# Altium schematic sheet Receiver.SchDoc
size A4; SheetNumber: 3; SheetTotal: 3
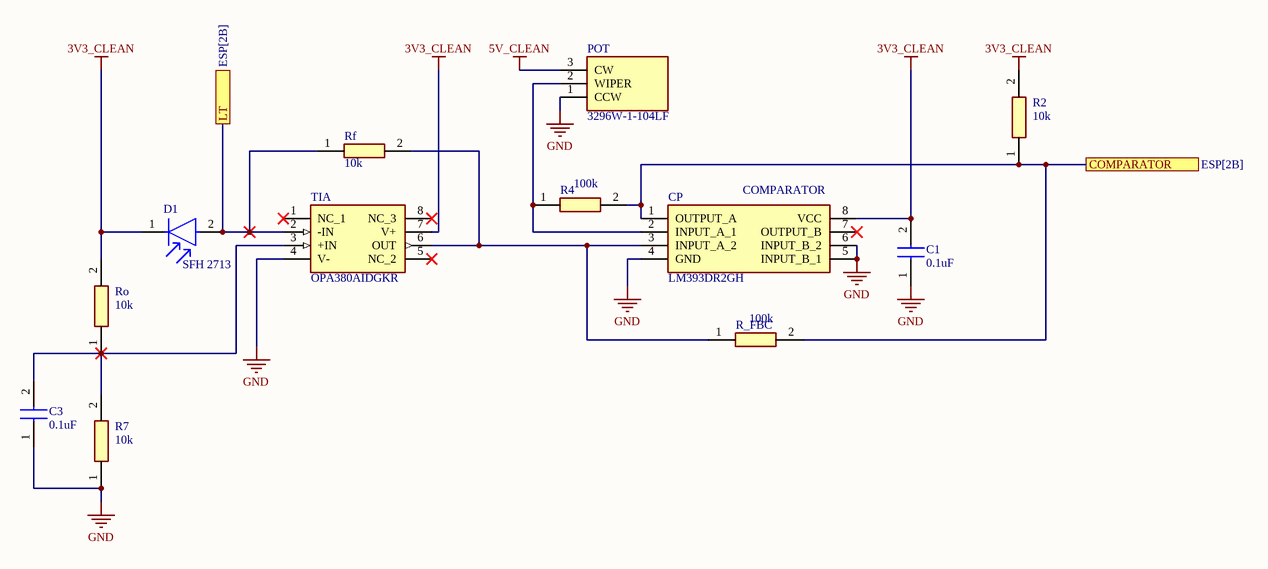
[diagram p0: Receiver.SchDoc]

## Parts
C1  0.1uF  [CAPC0603X33N]
C3  0.1uF  [CAPC0603X33N]
CP  LM393DR2GH  [SOIC127P600X175-8N]
D1  SFH 2713  [FP-SFH_2713-MFG]
POT  3296W-1-104LF  [3296W1503LF]
R2  10k  [RESC1608X55N]
R4  100k  [RESC1005X40N]
R7  10k  [RESC1608X55N]
R_FBC  100k  [RESC1005X40N]
Rf  10k  [RESC1608X55N]
Ro  10k  [RESC1608X55N]
TIA  OPA380AIDGKR  [SOP65P490X110-8N]

## Ports
COMPARATOR (see ESP[2B]), LT (see ESP[2B])

## Nets
3V3_CLEAN: C1.2 CP.8(VCC) D1.1(C) R2.2 Ro.2 TIA.7(V+)
5V_CLEAN: POT.3(CW)
GND: C1.1 C3.1 CP.4(GND) CP.5(INPUT_B_1) CP.6(INPUT_B_2) POT.1(CCW) R7.1 TIA.4(V-)
COMPARATOR: CP.1(OUTPUT_A) R2.1 R4.2 R_FBC.2 ; port COMPARATOR
LT: D1.2(A) Rf.1 TIA.2(-IN) ; port LT
NetC3_2: C3.2 R7.2 Ro.1 TIA.3(+IN)
NetCP_2: CP.2(INPUT_A_1) POT.2(WIPER) R4.1
NetCP_3: CP.3(INPUT_A_2) R_FBC.1 Rf.2 TIA.6(OUT)

Not connected (* = marked no-connect by the designer): CP 7(OUTPUT_B)*; TIA 1(NC_1)* 5(NC_2)* 8(NC_3)*

## Notes on the sheet
- (near CP) COMPARATOR

## Library data of the parts
C1 C3 = GRM033C71C104KE14D: Capacitor; Manufacturer_Name: Murata Electronics; Datasheet Link: https://search.murata.co.jp/Ceramy/image/img/A01X/G101/ENG/GRM033C71C104KE14-01A.pdf; Height: 0.33mm; Manufacturer_Part_Number: GRM033C71C104KE14D; Mouser Part Number: 81-GRM33C71C104KE14D; Mouser Price/Stock: https://www.mouser.co.uk/ProductDetail/Murata-Electronics/GRM033C71C104KE14D?qs=P%2FC4Eoq9CDzkjc0H6wJP9A%3D%3D; Arrow Part Number: GRM033C71C104KE14D; Arrow Price/Stock: https://www.arrow.com/en/products/grm033c71c104ke14d/murata-manufacturing?region=nac
CP = LM393DR2GH: Integrated Circuit; Manufacturer_Name: onsemi; Datasheet Link: https://www.arrow.com/en/products/lm393dr2gh/on-semiconductor; Height: 1.75mm; Manufacturer_Part_Number: LM393DR2GH; Mouser Part Number: 863-LM393DR2GH; Mouser Price/Stock: https://www.mouser.co.uk/ProductDetail/onsemi/LM393DR2GH?qs=VZGfJwuufXYqyz8qorfXHA%3D%3D; Arrow Part Number: LM393DR2GH; Arrow Price/Stock: https://www.arrow.com/en/products/lm393dr2gh/on-semiconductor?region=nac
D1 = CMP-62027-000005-1: Photodiodes Silicon PIN Photodiode 635 nm
POT = 3296W-1-104LF: Variable Resistor; Manufacturer_Name: Bourns; Datasheet Link: https://datasheet.datasheetarchive.com/originals/distributors/Datasheets-10/DSA-187647.pdf; Height: 10.28mm; Manufacturer_Part_Number: 3296W-1-104LF; Mouser Part Number: 652-3296W-1-104LF; Mouser Price/Stock: https://www.mouser.co.uk/ProductDetail/Bourns/3296W-1-104LF?qs=NxuKWO2Bm4Yv9t2iisRb6w%3D%3D; Arrow Part Number: 3296W-1-104LF; Arrow Price/Stock: https://www.arrow.com/en/products/3296w-1-104lf/bourns?utm_currency=USD&region=europe
R2 R7 Rf Ro = RC0603FR0710KL: Resistor; Manufacturer_Name: KEMET; Datasheet Link: http://www.yageo.com/documents/recent/PYu-RC0603_51_RoHS_L_v5.pdf; Height: 0.55mm; Manufacturer_Part_Number: RC0603FR0710KL; Arrow Part Number: RC0603FR0710KL; Arrow Price/Stock: https://www.arrow.com/en/products/rc0603fr-0710kl/yageo
R4 R_FBC = R0402_1%_100_K__RC0402FR-07100KL_: Resistor; Manufacturer_Name: YAGEO; Manufacturer_Part_Number: R0402 1% 100 K (RC0402FR-07100KL); Datasheet Link: https://www.yageo.com/upload/media/product/products/datasheet/rchip/PYu-RC_Group_51_RoHS_L_12.pdf; Height: 0.4mm
TIA = OPA380AIDGKR: Undefined or Miscellaneous; Manufacturer_Name: Texas Instruments; Datasheet Link: http://www.ti.com/general/docs/suppproductinfo.tsp?distId=26&gotoUrl=http%3A%2F%2Fwww.ti.com%2Flit%2Fgpn%2Fopa380; Height: 1.1mm; Manufacturer_Part_Number: OPA380AIDGKR; Mouser Part Number: 595-OPA380AIDGKR; Mouser Price/Stock: https://www.mouser.co.uk/ProductDetail/Texas-Instruments/OPA380AIDGKR?qs=7nS3%252BbEUL6se7xvHvUhv0w%3D%3D; Arrow Part Number: OPA380AIDGKR; Arrow Price/Stock: https://www.arrow.com/en/products/opa380aidgkr/texas-instruments?utm_currency=USD&region=europe